# Altium schematic sheet EPS_SCH.SchDoc
size A
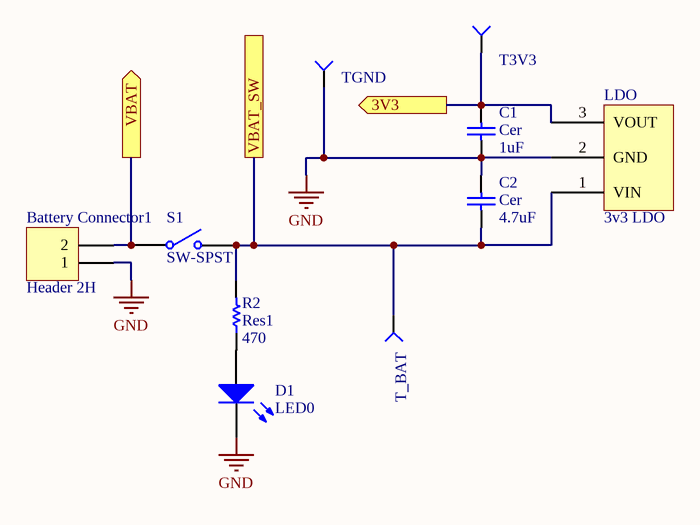
[diagram p0: EPS_SCH.SchDoc]

## Parts
Battery_Connector1  Header 2H  [BAT]
C1  Cer  value 1uF  [1608[0603]]
C2  Cer  value 4.7uF  [1608[0603]]
D1  LED0  [J1-0603]
LDO  3v3 LDO  [3V3LDO]
R2  Res1  value 470  [J1-0603]
S1  SW-SPST  [Switch]
T3V3  Testpoint  [TESTPOINT]  (value not drawn)  (no BOM)
T_BAT  Testpoint  [TESTPOINT]  (value not drawn)  (no BOM)
TGND  Testpoint  [TESTPOINT]  (value not drawn)  (no BOM)

## Ports
3V3 (out), VBAT (out), VBAT_SW

## Nets
GND: Battery_Connector1.1 C1.1 C2.2 D1.2(K) LDO.2(GND) TGND.1
3V3: C1.2 LDO.3(VOUT) T3V3.1 ; port 3V3
VBAT: Battery_Connector1.2 S1.1(COMMON) ; port VBAT
VBAT_SW: C2.1 LDO.1(VIN) R2.2 S1.2(NO) T_BAT.1 ; port VBAT_SW
NetD1_1: D1.1(A) R2.1

## Library data of the parts
Battery_Connector1 = Header 2H: Header, 2-Pin, Right Angle; LatestRevisionDate: 17-Jul-2002; LatestRevisionNote: Re-released for DXP Platform.; Publisher: Altium Limited
C1 C2 = Cap: Capacitor; Published: 8-Jun-2000; LatestRevisionDate: 17-Jul-2002; LatestRevisionNote: Re-released for DXP Platform.; PackageReference: RAD-0.3; Publisher: Altium Limited; PackageDescription: Radial Cap, Thru-Hole; 2 Leads; 0.3 in Pin Spacing
D1 = LED0: Typical INFRARED GaAs LED; Published: 8-Jun-2000; LatestRevisionDate: 08-Jul-2005; LatestRevisionNote: Mech Layer 1 removed.; PackageReference: LED-0; Publisher: Altium Limited; PackageDescription: LED; 2 Leads
LDO = 3v3 LDO: MCP1826S-3302E/AB
R2 = Res1: Resistor; Published: 8-Jun-2000; LatestRevisionDate: 17-Jul-2002; LatestRevisionNote: Re-released for DXP Platform.; PackageReference: AXIAL-0.3; Publisher: Altium Limited; PackageDescription: Axial Device, Thru-Hole; 2 Leads; 0.3 in Pin Spacing
S1 = SW-SPST: Single-Pole, Single-Throw Switch; Published: 24-Mar-1999; LatestRevisionDate: 17-Jul-2002; LatestRevisionNote: Re-released for DXP Platform.; PackageReference: SPST-2; Publisher: Altium Limited; PackageDescription: Switch; 2 Leads
T3V3 T_BAT TGND = Testpoint: Probe point for testing